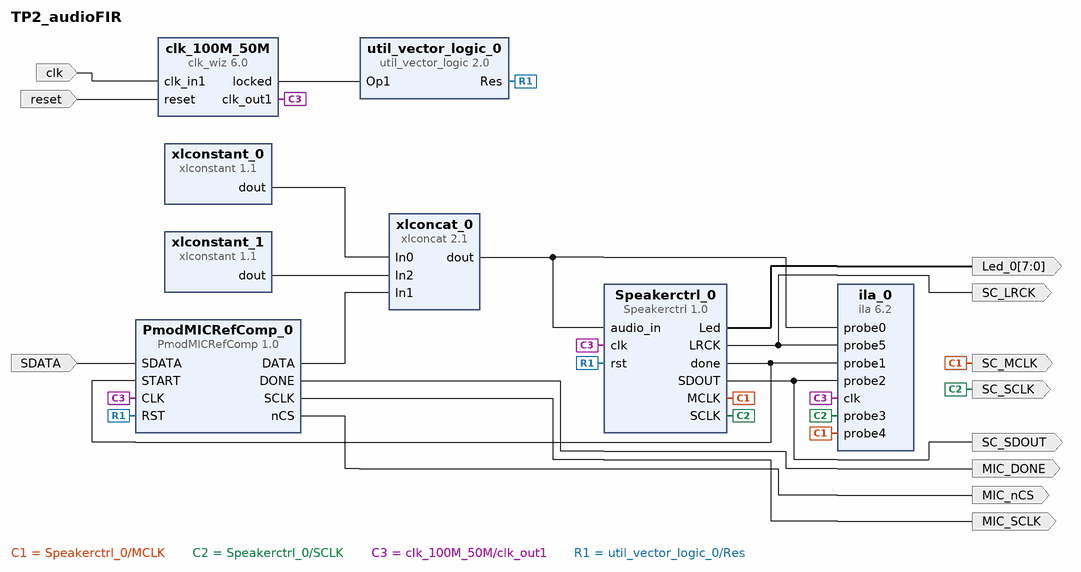
[diagram p0: block diagram of the top level]
# Vivado block design TP2_audioFIR, xc7a200tsbg484-1, Vivado 2021.2
create_bd_design TP2_audioFIR

create_bd_port -dir I -type rst reset
set_property -dict {CONFIG.POLARITY ACTIVE_HIGH} [get_bd_ports reset]
create_bd_port -dir I -type clk clk
create_bd_port -dir O -from 7 -to 0 -type data Led_0
create_bd_port -dir O -type data SC_SDOUT
create_bd_port -dir O -type data SC_SCLK
create_bd_port -dir O -type data SC_MCLK
create_bd_port -dir O -type data SC_LRCK
create_bd_port -dir O -type data MIC_SCLK
create_bd_port -dir O -type data MIC_nCS
create_bd_port -dir O -type data MIC_DONE
create_bd_port -dir I -type data SDATA

create_bd_cell -type ip -vlnv xilinx.com:user:Speakerctrl:1.0 Speakerctrl_0
create_bd_cell -type ip -vlnv xilinx.com:ip:clk_wiz:6.0 clk_100M_50M
set_property -dict [list \
  CONFIG.CLKOUT1_JITTER 151.636 \
  CONFIG.CLKOUT1_REQUESTED_OUT_FREQ 50.000 \
  CONFIG.CLK_IN1_BOARD_INTERFACE Custom \
  CONFIG.MMCM_CLKOUT0_DIVIDE_F 20.000 \
  CONFIG.PRIM_IN_FREQ 100.000 \
] [get_bd_cells clk_100M_50M]
create_bd_cell -type ip -vlnv xilinx.com:ip:util_vector_logic:2.0 util_vector_logic_0
set_property -dict {CONFIG.C_OPERATION not CONFIG.C_SIZE 1} [get_bd_cells util_vector_logic_0]
create_bd_cell -type ip -vlnv xilinx.com:user:PmodMICRefComp:1.0 PmodMICRefComp_0
create_bd_cell -type ip -vlnv xilinx.com:ip:ila:6.2 ila_0
set_property -dict [list \
  CONFIG.C_ENABLE_ILA_AXI_MON false \
  CONFIG.C_MONITOR_TYPE Native \
  CONFIG.C_NUM_OF_PROBES 6 \
  CONFIG.C_PROBE0_WIDTH 16 \
] [get_bd_cells ila_0]
create_bd_cell -type ip -vlnv xilinx.com:ip:xlconcat:2.1 xlconcat_0
set_property -dict {CONFIG.IN0_WIDTH 3 CONFIG.IN1_WIDTH 12 CONFIG.IN2_WIDTH 1 CONFIG.NUM_PORTS 3} [get_bd_cells xlconcat_0]
create_bd_cell -type ip -vlnv xilinx.com:ip:xlconstant:1.1 xlconstant_0
set_property -dict {CONFIG.CONST_VAL 0 CONFIG.CONST_WIDTH 3} [get_bd_cells xlconstant_0]
create_bd_cell -type ip -vlnv xilinx.com:ip:xlconstant:1.1 xlconstant_1
set_property -dict {CONFIG.CONST_VAL 0 CONFIG.CONST_WIDTH 1} [get_bd_cells xlconstant_1]

# ---- connections ----

connect_bd_net [get_bd_pins PmodMICRefComp_0/DATA] [get_bd_pins xlconcat_0/In1]
connect_bd_net [get_bd_pins PmodMICRefComp_0/DONE] [get_bd_ports MIC_DONE]
connect_bd_net [get_bd_pins PmodMICRefComp_0/SCLK] [get_bd_ports MIC_SCLK]
connect_bd_net [get_bd_pins PmodMICRefComp_0/nCS] [get_bd_ports MIC_nCS]
connect_bd_net -net SDATA_0_1 [get_bd_ports SDATA] [get_bd_pins PmodMICRefComp_0/SDATA]
connect_bd_net [get_bd_pins Speakerctrl_0/LRCK] [get_bd_ports SC_LRCK] [get_bd_pins ila_0/probe5]
connect_bd_net [get_bd_pins Speakerctrl_0/Led] [get_bd_ports Led_0]
connect_bd_net [get_bd_pins Speakerctrl_0/MCLK] [get_bd_ports SC_MCLK] [get_bd_pins ila_0/probe4]
connect_bd_net [get_bd_pins Speakerctrl_0/SCLK] [get_bd_ports SC_SCLK] [get_bd_pins ila_0/probe3]
connect_bd_net [get_bd_pins Speakerctrl_0/SDOUT] [get_bd_ports SC_SDOUT] [get_bd_pins ila_0/probe2]
connect_bd_net [get_bd_pins Speakerctrl_0/done] [get_bd_pins PmodMICRefComp_0/START] [get_bd_pins ila_0/probe1]
connect_bd_net -net audio_in_0_1 [get_bd_pins xlconcat_0/dout] [get_bd_pins Speakerctrl_0/audio_in] [get_bd_pins ila_0/probe0]
connect_bd_net [get_bd_ports clk] [get_bd_pins clk_100M_50M/clk_in1]
connect_bd_net [get_bd_pins clk_100M_50M/clk_out1] [get_bd_pins Speakerctrl_0/clk] [get_bd_pins PmodMICRefComp_0/CLK] [get_bd_pins ila_0/clk]
connect_bd_net [get_bd_pins clk_100M_50M/locked] [get_bd_pins util_vector_logic_0/Op1]
connect_bd_net [get_bd_ports reset] [get_bd_pins clk_100M_50M/reset]
connect_bd_net [get_bd_pins util_vector_logic_0/Res] [get_bd_pins Speakerctrl_0/rst] [get_bd_pins PmodMICRefComp_0/RST]
connect_bd_net [get_bd_pins xlconstant_0/dout] [get_bd_pins xlconcat_0/In0]
connect_bd_net [get_bd_pins xlconstant_1/dout] [get_bd_pins xlconcat_0/In2]

validate_bd_design
save_bd_design
